# EAGLE design BATT_INPUT (EAGLE 9.6.2)
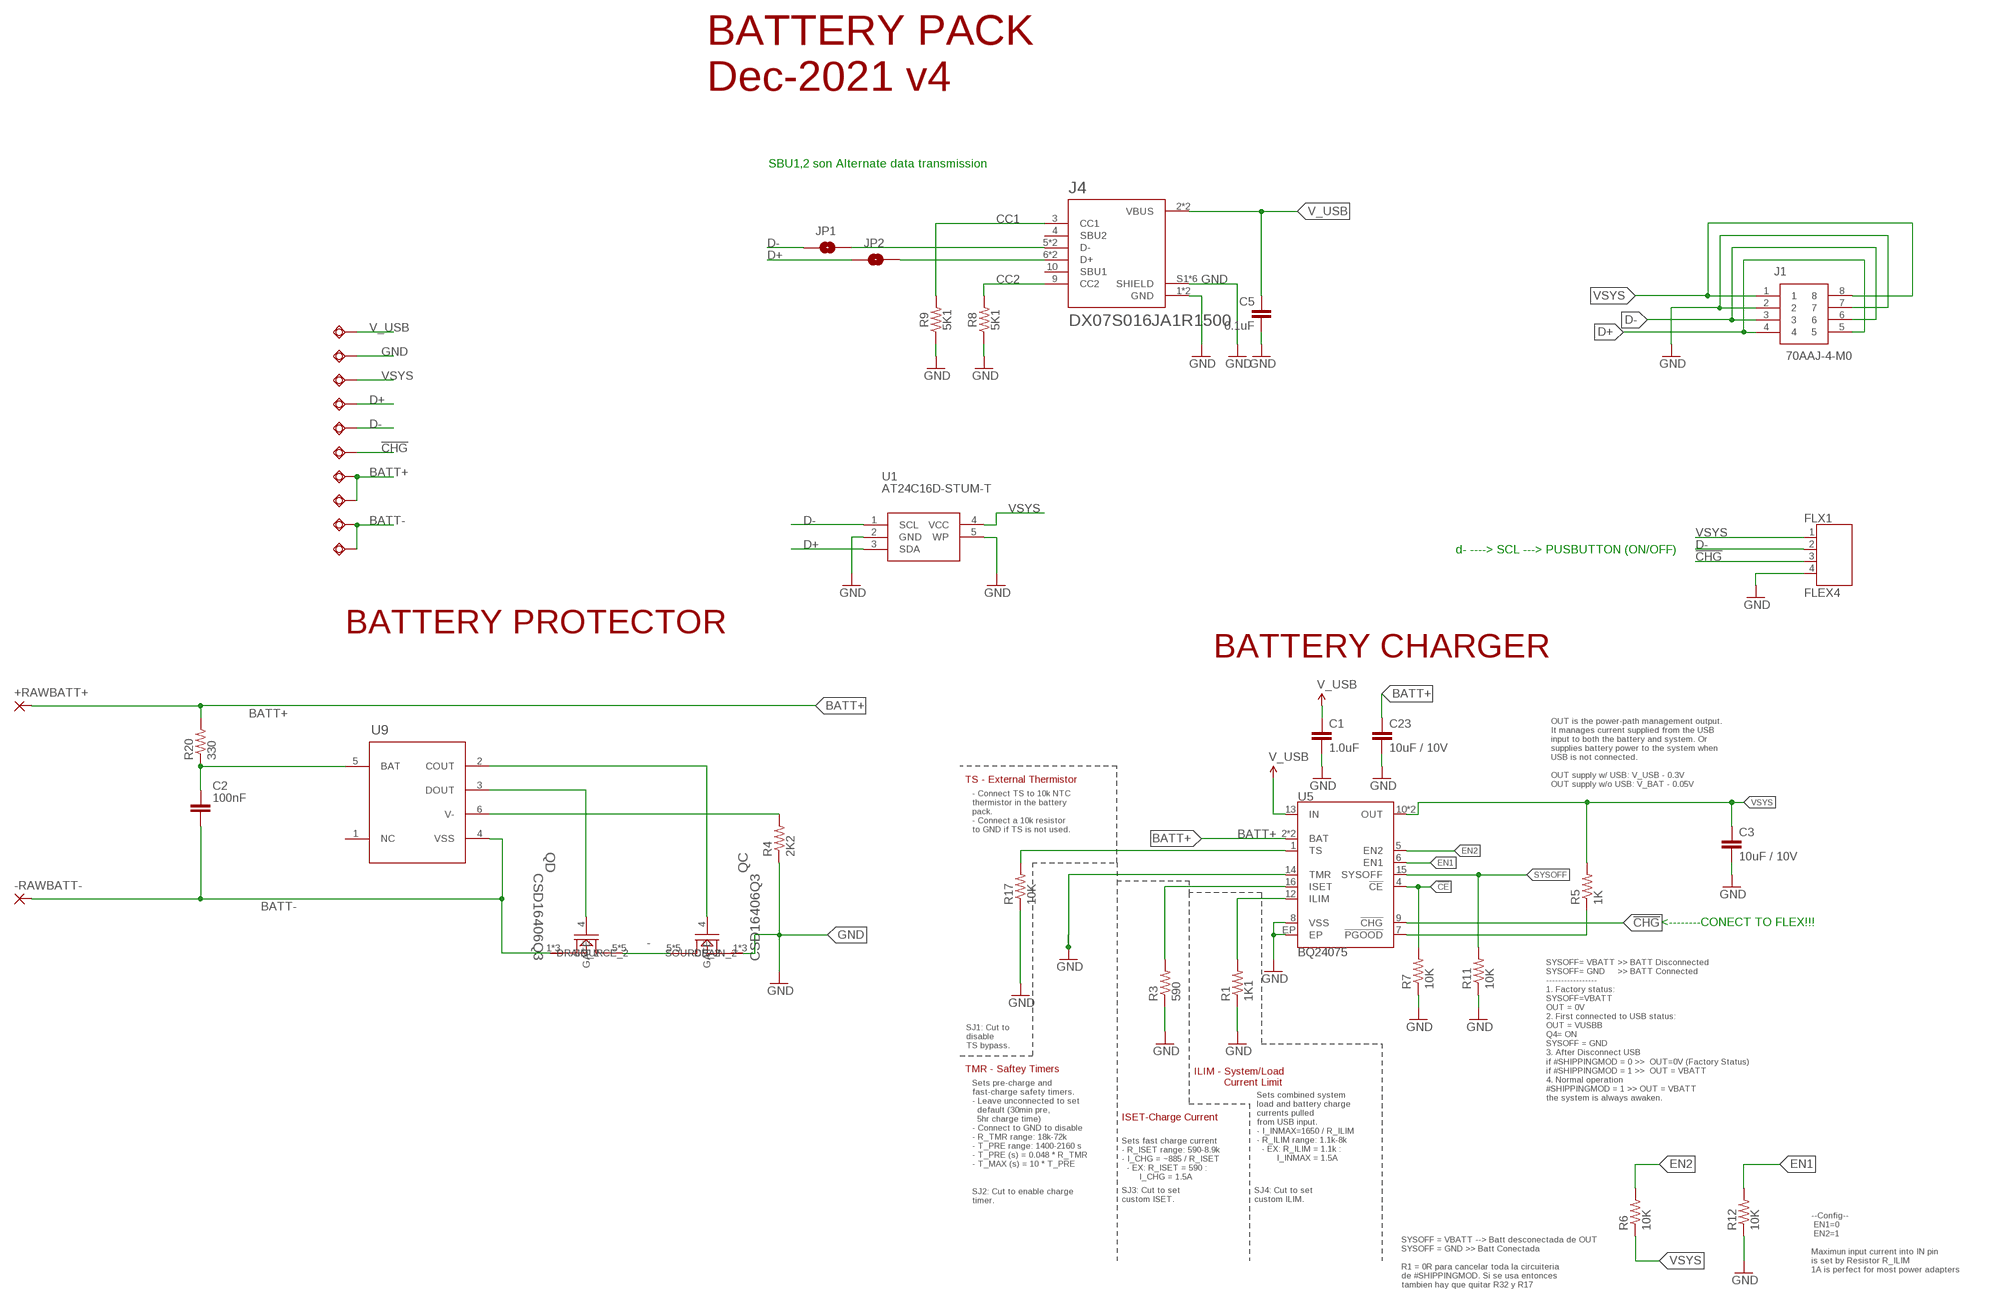
[diagram p0: schematic, sheet 1]

## Parts
!CHG!  TESTPAD_TPSQB1,27  [TESTPAD_B1,27]
+RAWBATT+  SMD5  [SMD2,54-5,08]
-RAWBATT-  SMD5  [SMD2,54-5,08]
BATT+1  TESTPAD_TPSQB1,27  [TESTPAD_B1,27]
BATT+2  TESTPAD_TPSQB1,27  [TESTPAD_B1,27]
BATT-1  TESTPAD_TPSQB1,27  [TESTPAD_B1,27]
BATT-2  TESTPAD_TPSQB1,27  [TESTPAD_B1,27]
C1  1.0uF  1.0UF-0603-16V-10%  [0603]
C2  100nF  C_CHIP-0603(1608-METRIC)  [CAPC1608X85]
C3  10uF / 10V  10UF10V10%(0805)  [0805-CAP]
C5  0.1uF  0.1UF-0603-25V-(+80/-20%)  [0603]
C23  10uF / 10V  10UF10V10%(0805)  [0805-CAP]
D+  TESTPAD_TPSQB1,27  [TESTPAD_B1,27]
D-  TESTPAD_TPSQB1,27  [TESTPAD_B1,27]
FLX1  FLEX4  [FLEX4]
GND  TESTPAD_TPSQB1,27  [TESTPAD_B1,27]
J1  70AAJ-4-M0  [70AAJ4M0]
J4  DX07S016JA1R1500  [JAE_DX07S016JA1R1500]
JP1  JUMPER-SMT_2_NO_SILK  [SMT-JUMPER_2_NO_SILK]
JP2  JUMPER-SMT_2_NO_SILK  [SMT-JUMPER_2_NO_SILK]
QC  CSD16406Q3  [DQG0008A]
QD  CSD16406Q3  [DQG0008A]
R1  1K1  RESISTOR0402  [0402]
R3  590  RESISTOR0402  [0402]
R4  2K2  RESISTOR0402  [0402]
R5  1K  RESISTOR0402  [0402]
R6  10K  RESISTOR0402  [0402]
R7  10K  RESISTOR0402  [0402]
R8  5K1  RESISTOR0402  [0402]
R9  5K1  RESISTOR0402  [0402]
R11  10K  RESISTOR0402  [0402]
R12  10K  RESISTOR0402  [0402]
R17  10K  RESISTOR0402  [0402]
R20  330  RESISTOR0402  [0402]
U1  AT24C16D-STUM-T  [SOT95P280X100-5N]
U5  BQ24075  [PVQFN-N16]
U9  Value  BQ29700DSER  [DSE0006A]
V_USB  TESTPAD_TPSQB1,27  [TESTPAD_B1,27]
VSYS  TESTPAD_TPSQB1,27  [TESTPAD_B1,27]

## Nets
!CE!: R7.2 U5.4(!CE!)
!CHG!: !CHG!.TP FLX1.3 U5.9(!CHG!)
-: QC.5(DRAIN_2) QC.6(DRAIN_2) QC.7(DRAIN_2) QC.8(DRAIN_2) QC.9(DRAIN_2) QD.5(DRAIN_2) QD.6(DRAIN_2) QD.7(DRAIN_2) QD.8(DRAIN_2) QD.9(DRAIN_2)
BATT+: +RAWBATT+.1(P) BATT+1.TP BATT+2.TP C23.1 R20.2 U5.2(BAT) U5.3(BAT)
BATT-: -RAWBATT-.1(P) BATT-1.TP BATT-2.TP C2.2 QD.1(SOURCE_2) QD.2(SOURCE_2) QD.3(SOURCE_2) U9.4(VSS)
CC1: J4.3(CC1) R9.2
CC2: J4.9(CC2) R8.2
D+: D+.TP J1.4 J1.5 JP2.1 U1.3(SDA)
D-: D-.TP FLX1.2 J1.3 J1.6 JP1.1 U1.1(SCL)
EN1: R12.2 U5.6(EN1)
EN2: R6.2 U5.5(EN2)
GND: C1.2 C3.2 C5.2 C23.2 FLX1.4 GND.TP J1.2 J1.7 J4.1(GND) J4.12(GND) J4.S1(SHIELD) J4.S2(SHIELD) J4.S3(SHIELD) J4.S4(SHIELD) J4.S5(SHIELD) J4.S6(SHIELD) QC.1(SOURCE_2) QC.2(SOURCE_2) QC.3(SOURCE_2) R1.1 R3.1 R4.1 R7.1 R8.1 R9.1 R11.1 R12.1 R17.1 U1.2(GND) U1.5(WP) U5.8(VSS) U5.14(TMR) U5.EP
ILIM: R1.2 U5.12(ILIM)
ISET: R3.2 U5.16(ISET)
N$1: R5.1 U5.7(!PGOOD!)
N$2: J4.5(D-) J4.8(D-) JP1.2
N$3: J4.6(D+) J4.7(D+) JP2.2
N$12: C2.1 R20.1 U9.5(BAT)
N$20: R4.2 U9.6(V-)
N$25: QC.4(GATE) U9.2(COUT)
N$26: QD.4(GATE) U9.3(DOUT)
SYSOFF: R11.2 U5.15(SYSOFF)
TS1: R17.2 U5.1(TS)
V_USB: C1.1 C5.1 J4.2(VBUS) J4.11(VBUS) U5.13(IN) V_USB.TP
VSYS: C3.1 FLX1.1 J1.1 J1.8 R5.2 R6.1 U1.4(VCC) U5.10(OUT) U5.11(OUT) VSYS.TP
Unconnected: J4.4(SBU2) J4.10(SBU1) U9.1(NC)

## Notes on the sheet
- BATTERY PACK
  Dec-2021 v4
- SBU1,2 son Alternate data transmission
- d- ----> SCL ---> PUSBUTTON (ON/OFF)
- BATTERY PROTECTOR
- BATTERY CHARGER
- OUT is the power-path management output.
  It manages current supplied from the USB 
  input to both the battery and system. Or
  supplies battery power to the system when 
  USB is not connected.
  
  OUT supply w/ USB: V_USB - 0.3V
  OUT supply w/o USB: V_BAT - 0.05V
- TS - External Thermistor
- - Connect TS to 10k NTC 
  thermistor in the battery
  pack.
  - Connect a 10k resistor 
  to GND if TS is not used.
- <--------CONECT TO FLEX!!!
- SYSOFF= VBATT >> BATT Disconnected
  SYSOFF= GND     >> BATT Connected
  -----------------
  1. Factory status:
  SYSOFF=VBATT
  OUT = 0V
  2. First connected to USB status:
  OUT = VUSBB
  Q4= ON
  SYSOFF = GND
  3. After Disconnect USB
  if #SHIPPINGMOD = 0 >>  OUT=0V (Factory Status)
  if #SHIPPINGMOD = 1 >>  OUT = VBATT
  4. Normal operation
  #SHIPPINGMOD = 1 >> OUT = VBATT 
  the system is always awaken.
- SJ1: Cut to 
  disable
  TS bypass.
- TMR - Saftey Timers
- ILIM - System/Load 
            Current Limit
- Sets pre-charge and
  fast-charge safety timers.
  - Leave unconnected to set
    default (30min pre, 
    5hr charge time)
  - Connect to GND to disable
  - R_TMR range: 18k-72k
  - T_PRE range: 1400-2160 s
  - T_PRE (s) = 0.048 * R_TMR
  - T_MAX (s) = 10 * T_PRE
- Sets combined system
  load and battery charge 
  currents pulled
  from USB input.
  - I_INMAX=1650 / R_ILIM
  - R_ILIM range: 1.1k-8k
    - EX: R_ILIM = 1.1k : 
          I_INMAX = 1.5A
- ISET-Charge Current
- Sets fast charge current
  - R_ISET range: 590-8.9k
  - I_CHG = ~885 / R_ISET
    - EX: R_ISET = 590 : 
         I_CHG = 1.5A
- SJ3: Cut to set
  custom ISET.
- SJ4: Cut to set
  custom ILIM.
- SJ2: Cut to enable charge
  timer.
- --Config--
   EN1=0 
   EN2=1
  
  Maximun input current into IN pin
  is set by Resistor R_ILIM
  1A is perfect for most power adapters
- SYSOFF = VBATT --> Batt desconectada de OUT
  SYSOFF = GND >> Batt Conectada
  
  R1 = 0R para cancelar toda la circuiteria
  de #SHIPPINGMOD. Si se usa entonces
  tambien hay que quitar R32 y R17

## Library data of the parts
!CHG! BATT+1 BATT+2 BATT-1 BATT-2 D+ D- GND V_USB VSYS = BeagleBone_Blue_R3:TESTPAD_TPSQ: Test pad
+RAWBATT+ -RAWBATT- = wirepad:SMD5: SMD PAD
C1 = SparkFun-Capacitors:1.0UF: 1µF ceramic capacitors A capacitor is a passive two-terminal electrical component used to store electrical energy temporarily in an electric field.; PROD_ID: CAP-00868
C2 = Tutorial - Fusion 360:C: Capacitor - Generic; CATEGORY: Capacitor
C3 C23 = SparkFun-Capacitors:10UF10V10%(0805): CAP-11330; PROD_ID: CAP-11330
C5 = SparkFun-Capacitors:0.1UF: 0.1µF ceramic capacitors A capacitor is a passive two-terminal electrical component used to store electrical energy temporarily in an electric field.; PROD_ID: CAP-00810
FLX1 = Flex4:FLEX4
J1 = ANTENNA:70AAJ-4-M0: Bourns Male 4 Way Modular Contact, Surface Mount, 3A, 60 V Source: Datasheet <https://componentsearchengine.com/Datasheets/1/70AAJ-4-M0.pdf>; DESCRIPTION: Bourns Male 4 Way Modular Contact, Surface Mount, 3A, 60 V; HEIGHT: 3.81mm; MANUFACTURER_NAME: Bourns; MANUFACTURER_PART_NUMBER: 70AAJ-4-M0; MOUSER_PART_NUMBER: 652-70AAJ-4-M0; MOUSER_PRICE-STOCK: https://www.mouser.com/Search/Refine.aspx?Keyword=652-70AAJ-4-M0
J4 = DX07S016JA1R1500:DX07S016JA1R1500: USB-C (USB TYPE-C) USB 2.0 Receptacle Connector 24 (16+8 Dummy) Position Surface Mount, Right Angle; Through Hole; DESCRIPTION: USB-C (USB TYPE-C) USB 2.0 Receptacle Connector 24 (16+8 Dummy) Position Surface Mount, Right Angle; Through Hole; DIGI-KEY_PART_NUMBER: 670-DX07S016JA1R1500CT-ND; MF: JAE Electronics; MP: DX07S016JA1R1500; PACKAGE: None; PURCHASE-URL: https://pricing.snapeda.com/search/part/DX07S016JA1R1500/?ref=eda
JP1 JP2 = SparkFun-Jumpers:JUMPER-SMT_2_NO: Normally open jumper This jumper has two pads in close proximity to each other. Apply solder to close the connection. Round pads are easier to solder for beginners, but are a lot larger. SparkFun Product that uses the round pads: SparkFun EL Sequencer <https://www.sparkfun.com/products/12781>
QC QD = CSD16406Q3:CSD16406Q3; DATASHEET_URL: http://www.ti.com/lit/ds/symlink/csd16406q3.pdf; IDSMAX: 60.0; MANUFACTURER_PART_NUMBER: CSD16406Q3; QGTYP: 5.8; QUANTITY: 1; RDSON45: 0.0059; VDSMAX: 25.0; VENDOR: Texas Instruments
R1 R3-R9 R11 R12 R17 R20 = SparkFun-Resistors:RESISTOR: Generic Resistor Package
U1 = AT24C16D-STUM-T:AT24C16D-STUM-T: EEPROM Serial-2Wire 16K-bit 2K x 8 1.8V/2.5V/3.3V 5-Pin SOT-23 T/R Source: Datasheet <https://www.arrow.com/en/products/at24c16d-stum-t/microchip-technology>; ARROW_PART_NUMBER: AT24C16D-STUM-T; ARROW_PRICE-STOCK: https://www.arrow.com/en/products/at24c16d-stum-t/microchip-technology; DESCRIPTION: EEPROM Serial-2Wire 16K-bit 2K x 8 1.8V/2.5V/3.3V 5-Pin SOT-23 T/R; HEIGHT: 1mm; MANUFACTURER_NAME: Microchip; MANUFACTURER_PART_NUMBER: AT24C16D-STUM-T; MOUSER_PART_NUMBER: 556-AT24C16D-STUM-T; MOUSER_PRICE-STOCK: https://www.mouser.co.uk/ProductDetail/Microchip-Technology-Atmel/AT24C16D-STUM-T?qs=YAvGbpKWXiSFXLERVL65hQ%3D%3D
U5 = battery-management-temp:BQ24075; PROD_ID: IC-13219
U9 = BQ2970:BQ29700DSER; MANUFACTURER: Texas Instruments; PARTNUMBER: BQ29705DSER; REFDES: RefDes; TYPE: TYPE

## Net classes
1 power: width 0.178 mm
2 gnd: width 0.305 mm, drill 0.483 mm, clearance 0.203 mm

## Board
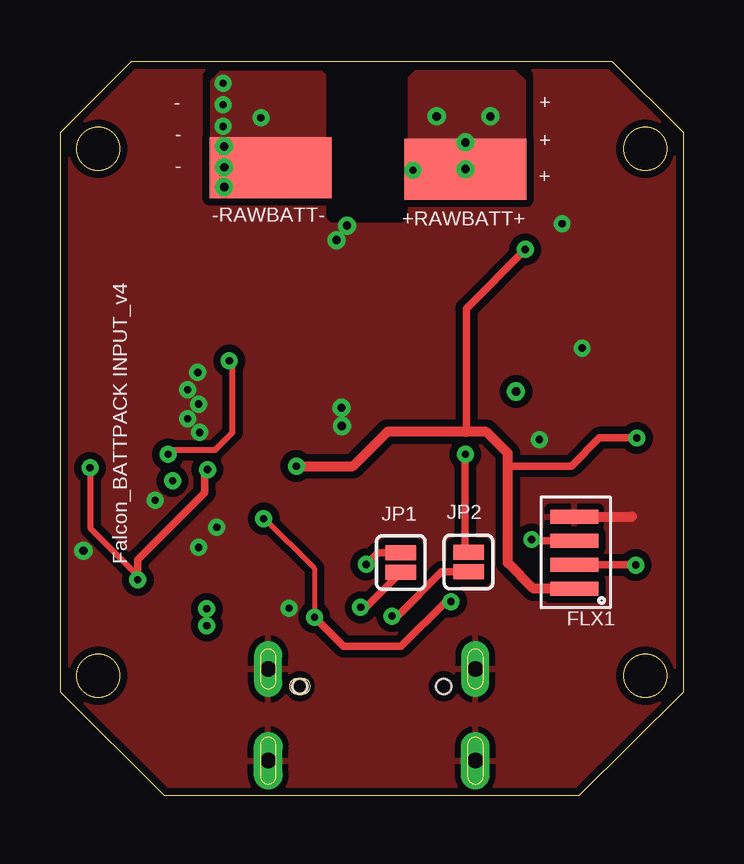
[diagram p1: board, top side]
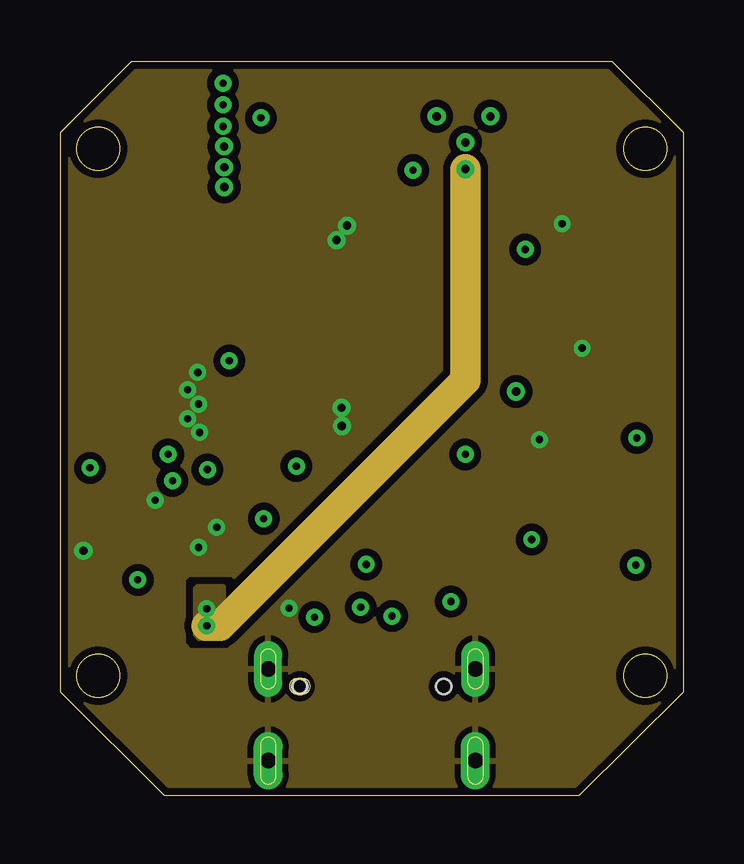
[diagram p2: board, inner layer Route2]
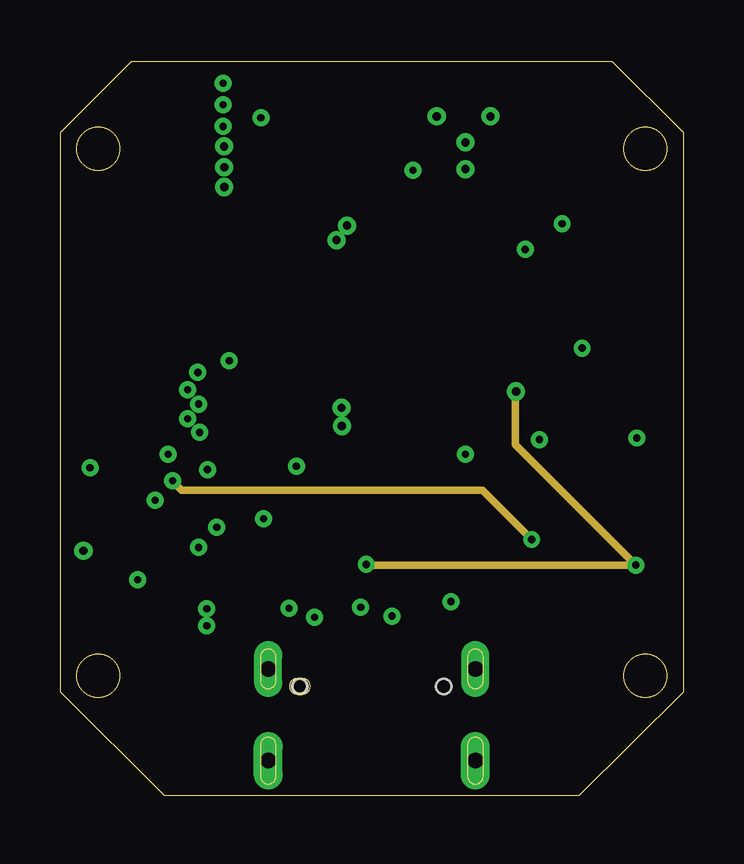
[diagram p3: board, inner layer Route15]
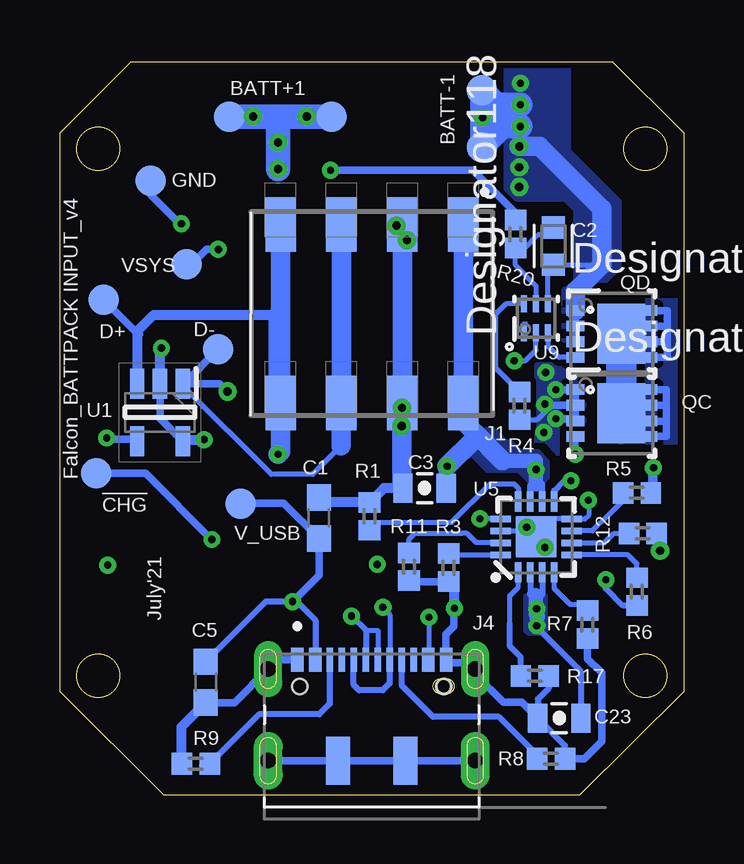
[diagram p4: board, bottom side, seen from below]

Size 26 x 30.58 mm. Coordinates in mm from the lower left corner, seen from the top.
Outline: 21.65,0 26,4.32 26,27.61 23.03,30.57 2.97,30.57 0,27.61 0,4.32 4.35,0 21.65,0
Outline: circle at 1.6,4.99 radius 0.9
Outline: circle at 24.4,4.99 radius 0.9
Outline: circle at 24.4,26.95 radius 0.9
Outline: circle at 1.6,26.95 radius 0.9
Copper layers (1+2*15+16): Top 0.035mm / dielectric 1.5mm / Route2 0.035mm / dielectric 0.15mm / Route15 0.035mm / dielectric 0.2mm / Bottom 0.035mm
Design rules "default *": minimum track width 6mil, minimum drill 0.3mm, track to track 7mil, track to pad 7mil, pad to pad 7mil, via to via 7mil, smd to smd 6mil, copper to edge 10mil, drill to drill 10mil, minimum pad ring 10mil, minimum via ring 8mil, stop-mask expansion 4mil, vias tented up to drill 50mil, thermal gap 10mil
tRestrict: area 11.4,24.2 to 14.2,30.1

### Footprints (pad centres in the part's own frame; a part is rotated, then mirrored left to right if it is on the bottom)
TESTPAD_B1,27 = smd 1.27 x 1.27: TP 0,0
SMD2,54-5,08 = smd 2.54 x 5.08: 1 0,0
0603 = smd 1.1 x 1: 1 -0.85,0; 2 0.85,0
CAPC1608X85 = smd 0.921 x 0.97: 1 -0.775,0; 2 0.775,0
0805-CAP = smd 0.8 x 1.2: 1 -0.9,0; 2 0.9,0
FLEX4 = smd 0.6 x 2: 1 -3.77,1.52; 2 -2.77,1.52; 3 -1.77,1.52; 4 -0.77,1.52
70AAJ4M0 = smd 1.27 x 2.26: 1 -3.81,-3.72; 2 -1.27,-3.72; 3 1.27,-3.72; 4 3.81,-3.72; 5 3.81,3.72; 6 1.27,3.72; 7 -1.27,3.72; 8 -3.81,3.72
JAE_DX07S016JA1R1500 = smd 0.52 x 1: 1 -3.1,1.1; 2 -2.35,1.1; 11 2.35,1.1; 12 3.1,1.1 | smd 0.27 x 1: 3 -1.75,1.1; 4 -1.25,1.1; 5 -0.75,1.1; 6 -0.25,1.1; 7 0.25,1.1; 8 0.75,1.1; 9 1.25,1.1; 10 1.75,1.1 | smd 1 x 2: S1 -1.4,-3.1; S2 1.4,-3.1 | drill 0.65 long: S3 -4.32,0.725; S4 4.32,0.725 | drill 0.65 pad 1.2 long: S5 -4.32,-3.1; S6 4.32,-3.1 | hole 0.6: 3,0 | hole 0.63: 3,0; -3,0
SMT-JUMPER_2_NO_SILK = smd 0.635 x 1.27: 1 -0.406,0; 2 0.406,0
DQG0008A = smd 0.75 x 0.44: 1 -1.525,0.975; 2 -1.525,0.325; 3 -1.525,-0.325; 4 -1.525,-0.975; 5 1.525,-0.975; 6 1.525,-0.325; 7 1.525,0.325; 8 1.525,0.975 | smd 2 x 2.5: 9 0.4,0 | smd 0.5 x 0.5: V 0.226,0.975
0402 = smd 0.85 x 0.9: 1 -0.58,0; 2 0.58,0
SOT95P280X100-5N = smd 1.25 x 0.6: 1 -1.2,0.95; 2 -1.2,0; 3 -1.2,-0.95; 4 1.2,-0.95; 5 1.2,0.95
PVQFN-N16 = smd 0.28 x 0.85: 1 -0.75,-1.475; 2 -0.25,-1.475; 3 0.25,-1.475; 4 0.75,-1.475; 9 0.75,1.475; 10 0.25,1.475; 11 -0.25,1.475; 12 -0.75,1.475 | smd 0.85 x 0.28: 5 1.475,-0.75; 6 1.475,-0.25; 7 1.475,0.25; 8 1.475,0.75; 13 -1.475,0.75; 14 -1.475,0.25; 15 -1.475,-0.25; 16 -1.475,-0.75 | smd 1.7 x 1.7: EP 0,0
DSE0006A = smd 0.66 x 0.25: 1 -0.62,0.5 | smd 0.7 x 0.25: 2 -0.6,0; 3 -0.6,-0.5; 4 0.6,-0.5; 5 0.6,0; 6 0.6,0.5

### Placement (x,y rotation side)
!CHG!  24.5,13.42 0 bottom
+RAWBATT+  16.91,26.09 90 top
-RAWBATT-  8.78,26.15 90 top
BATT+1  18.94,28.27 0 bottom
BATT+2  14.68,28.27 0 bottom
BATT-1  8.4,27.01 0 bottom
BATT-2  8.4,29.37 0 bottom
C1  15.21,11.56 90 bottom
C2  5.43,22.89 270 bottom
C3  10.8,12.8 180 bottom
C5  19.92,4.72 270 bottom
C23  5.18,3.22 180 bottom
D+  24.17,20.65 0 bottom
D-  19.4,18.6 0 bottom
FLX1  22.96,12.38 90 top
GND  22.23,25.61 0 bottom
J1  12.99,20.07 180 bottom
J4  13,4.55 0 bottom
JP1  14.21,9.7 270 top
JP2  17.03,9.72 270 top
QC  2.99,15.93 0 bottom
QD  2.99,19.23 0 bottom
R1  1K5  [0402]  13.09,11.63 270 bottom
R3  909R  [0402]  9.79,9.49 90 bottom
R4  6.84,16.23 90 bottom
R5  100k  [0402]  1.94,12.61 0 bottom
R6  1.94,8.49 90 bottom
R7  4.01,7.12 90 bottom
R8  5.52,1.53 180 bottom
R9  20.34,1.32 0 bottom
R11  11.45,9.53 90 bottom
R12  1.7,10.92 180 bottom
R17  6.2,4.98 180 bottom
R20  7.01,23.39 90 bottom
U1  21.83,15.96 270 bottom
U5  6.14,10.77 0 bottom
U9  BQ29700DSER  [DSE0006A]  6.15,19.88 90 bottom
V_USB  18.47,12.15 0 bottom
VSYS  20.72,22.12 0 bottom

### Tracks (layer width: path | path; a pad name or v marks a point on that pad's centre or on a via)
!CE!
  Bottom 0.2: R7.2 4.26,7.95 4.72,7.95 5.39,8.62 U5.4
!CHG!  (via drill 0.3)
  Top 0.305: FLX1.3 19.63,10.61 19.62,10.62 v19.67,10.66
  Route15 0.305: v19.67,10.66 17.61,12.72 5.08,12.72 v4.7,13.11
  Bottom 0.254: U5.9 5.39,12.7 5,13.09 4.72,13.09 v4.7,13.11
  Bottom 0.305: v19.67,10.66 22.43,13.42 !CHG!.TP
-
  Bottom 0.305: QD.8 0.67,20.2 0.67,19.55 | QD.7 0.67,19.55 | 0.67,19.55 0.67,18.9 | 0.67,18.9 QD.6 | QC.8 0.73,16.91 0.72,16.9 0.72,16.27 | 0.72,16.27 0.75,16.25 1.45,16.25 QC.7 | 0.72,16.27 0.72,15.62 0.75,15.6 | 0.75,15.6 QC.6 | 0.67,18.9 0.67,18.27 0.69,18.25 QD.5 | 0.75,15.6 0.72,15.57 0.72,14.97 0.74,14.96 QC.5
  Bottom 1.27: QC.9 2.59,17.57 QD.9
  pour Bottom: 2.7,20.67 2.7,14.67 0.1,14.67 0.1,20.67
BATT+  (via drill 0.3, 0.35)
  Top 0.305: +RAWBATT+.1 16.81,26 15.25,26 15.2,26.05 v14.72,26.05
  Route2 1.27: +RAWBATT+.1 16.91,17.31 6.67,7.07 v6.12,7.07
  Bottom 0.254: U5.3 5.89,8.35 5.9,8.35 6.15,8.35 6.37,8.35 6.41,8.38 6.39,8.4 U5.2 | v6.12,7.07 6.12,7.01 4.28,5.17 C23.1
  Bottom 0.305: R20.2 7.01,24.27 8.78,26.05 v14.72,26.05
  Bottom 0.61: 6.15,8.35 6.15,7.55 6.07,7.47 6.12,7.42 v6.12,7.07
  Bottom 1.016: BATT+2.TP 16.91,28.27 | 16.91,28.27 BATT+1.TP | 16.91,28.27 +RAWBATT+.1
  other vias: 16.91,26.09 6.12,7.77 15.71,28.29 17.95,28.29 16.91,27.21
  pour Bottom: 5.8,8.37 5.7,8.37 5.7,6.82 5.85,6.67 6.5,6.67 6.65,6.82 6.65,8.37
  pour Route2: 5.55,8.32 5.55,6.67 5.6,6.62 5.75,6.47 6.7,6.47 6.9,6.67 6.9,6.72 6.9,8.72 6.85,8.77 5.7,8.77 5.55,8.62
  pour Top (isolate 0.305, no thermals): 14.4,26.97 19.4,26.97 19.4,29.77 19,30.17 14.8,30.17 14.4,29.77
BATT-  (via drill 0.3, 0.35)
  Bottom 0.203: U9.4 5.65,21.92 5.46,22.11 C2.2 3.41,22.11
  Bottom 0.305: QD.3 QD.2 QD.1
  Bottom 0.813: 3.41,22.11 3.41,24.44 6.02,27.04 v6.85,27.04 v6.86,27.05 | QD.1 4.51,21.01 3.41,22.11
  Bottom 1.016: v6.8,28.77 7.8,28.77 BATT-2.TP 8.38,29.35 v8.38,28.23 8.38,27.03 BATT-1.TP 8.4,27.03 7.56,27.87 v6.8,27.87
  other vias: 6.85,26.17 6.85,25.35 6.8,29.67
  pour Top (no thermals): 10.85,25.67 9.05,25.07 9.05,25.67
  pour Bottom: 7.5,30.27 7.5,25.11 7.16,24.77 5,24.77 4.6,24.37 4.6,21.47 4.9,21.17 5,21.17 5.1,21.07 5.1,18.97 5,18.87 4.5,18.87 4.2,19.17 4.2,20.77 3.6,21.37 3.2,21.37 2.6,21.97 2.6,24.77 4.7,26.87 4.7,30.27
  pour Top (isolate 0.305, no thermals): 6.3,27.37 6.3,29.77 6.7,30.17 10.9,30.17 11.2,29.87 11.2,27.27 6.3,27.27
CC1
  Bottom 0.2: R9.2 20.11,1.25 | J4.3
  Bottom 0.254: R9.2 17.7,3.37 15.2,3.37 14.75,3.82 J4.3
CC2
  Bottom 0.254: R8.2 6.1,1.68 7.7,3.27 10.45,3.27 11.75,4.58 J4.9
D+  (via drill 0.3)
  Top 0.305: JP2.1 16.89,10.27 16.89,14.19 v16.9,14.21
  Bottom 0.305: 16.9,15.88 v16.9,14.21 | 22.74,19.37 22.74,19.22 D+.TP
  Bottom 0.406: 22.74,19.22 22.78,19.18 U1.3 | 22.74,19.37 22.09,20.02 16.88,20.02
  Bottom 0.813: J1.4 J1.5 16.8,14.31 v16.9,14.21 | 16.88,20.02 16.9,20 16.9,15.88
D-  (via drill 0.3, 0.35)
  Top 0.305: FLX1.2 v24.01,9.61 v24.02,9.61 v24.01,9.6 | v12.77,9.62 13.25,10.11 JP1.1
  Route15 0.305: v12.77,9.62 12.75,9.61 12.76,9.6 v24.01,9.6 19,14.61 19,16.81 v19.02,16.83
  Bottom 0.203: 20.88,17.07 17.18,13.37 15.47,13.37 14.28,14.56
  Bottom 0.305: D-.TP 20.83,17.16 | 20.83,17.16 U1.1 | v19.02,16.83 19.35,17.16 20.83,17.16
  Bottom 0.406: U1.1 20.88,17.07
  Bottom 0.813: J1.3 J1.6 14.28,16.33 14.28,14.56
EN1
  Bottom 0.2: U5.6 3.3,10.52 2.9,10.92 R12.2
EN2
  Bottom 0.2: R6.2 1.94,9.65 2.31,10.02 U5.5
GND  (via drill 0.3, 0.35)
  Top 0.406: FLX1.4 23.86,11.61
  Bottom 0.2: U5.14 6.39,11.02 U5.EP | U5.EP | U5.EP 6.14,10.88 5.51,11.52 U5.8 4.11,11.52 3.93,11.7 3.93,12.25 v3.97,12.29
  Bottom 0.203: R4.1 6.09,15.65 5.48,16.26
  Bottom 0.254: R17.1 5.62,4.47 6.08,4.01 C23.2 4.94,2.08 R8.1 | R12.1 1.12,10.33 v0.98,10.19
  Bottom 0.305: QC.2 QC.3 4.6,15.7 v5.32,15.7 | QC.2 QC.1 4.52,16.9 v5.32,16.9 | R3.1 11.41,8.91 R11.1 | 6.14,3.27 C23.2 6.74,3.87 7.52,3.87 8.68,5.04 J4.S4 8.93,5.52 9.78,5.52 J4.12 9.9,6.71 9.56,7.05 v9.56,7.79 | 11.74,12.84 C3.2 | J4.1 16.95,5.65 J4.S3 18.73,3.87 C5.2 | J4.S6 J4.S2 J4.S1 J4.S5 | 21.84,15.72 U1.5 21.83,15.71 U1.2 | GND.TP 22.23,25.03 20.98,23.78 v20.94,23.82 | R7.1 4.01,5.7 3.41,5.1 3.41,2.26 4.14,1.53 R8.1 | QC.2 5.48,16.26
  Bottom 0.406: C5.2 20.95,2.84 20.95,1.35 R9.1 | C1.2 15.03,12.23 13.12,12.23 R1.1 12.5,12.8 C3.2 | R3.1 9.56,8.68 v9.56,7.79 v9.55,7.79 | U1.5 20.82,14.82 v20,14.82 v19.99,14.83 | U1.2 21.83,18.5 21.73,18.6 v21.77,18.64
  Bottom 0.813: 11.72,12.86 11.74,12.84 11.74,16.33 J1.7 | v11.97,23.74 11.87,23.64 J1.2 J1.7 | J1.7 11.76,16.31 v11.76,15.39
  other vias: 5.78,16.31 5.82,15.12 5.75,17.62 11.74,16.15 11.53,23.13 6.54,11.17 5.78,10.33
  pour Top (isolate 0.305, rank 3): -0.36,31.53 -0.36,-0.24 26.59,-0.24 26.59,28.25 23.31,31.53
  pour Route2 (isolate 0.305, rank 2): -0.95,31.3 -0.95,-1.08 27.65,-1.08 27.65,31.3
  pour Bottom (isolate 0.254, rank 2): 4.1,18.05 4.1,15.37 5.2,15.37 5.2,14.17 6.2,14.17 6.2,18.05
ILIM
  Bottom 0.2: U5.12 6.88,12.79 7.06,12.97 8.07,12.97 9.67,11.37 12.77,11.37 R1.2
ISET
  Bottom 0.2: R3.2 9.74,10.02 U5.16
N$1
  Bottom 0.2: R5.1 2.52,12.29 3.12,11.69 3.12,11.7 3.8,11.02 U5.7
N$2  (via drill 0.3)
  Top 0.305: JP1.2 12.75,7.84 v12.54,7.84
  Bottom 0.203: 12.54,7.81 12.25,7.52 J4.8
  Bottom 0.254: v12.54,7.84 12.54,7.81 | J4.8 12.25,4.67 12.55,4.37 13.52,4.37 13.75,4.6 J4.5
N$3  (via drill 0.3)
  Top 0.305: JP2.2 15.91,9.31 14.07,7.47 v13.85,7.47
  Bottom 0.203: 13.25,6.87 12.75,6.87 J4.7
  Bottom 0.254: v13.85,7.47 13.25,6.87 J4.6 | J4.7
N$12
  Bottom 0.203: U9.5 6.15,21.22 7.01,22.08 R20.1 6.62,22.81 6.07,23.35 5.62,23.35 5.43,23.55 C2.1
N$20
  Bottom 0.203: U9.6 7.41,20.48 7.82,20.07 7.82,17.8 R4.2
N$25  (via drill 0.3)
  Top 0.254: v4.51,14.21 4.68,14.38 6.46,14.38 7.2,15.12 7.2,17.97 v7.06,18.11
  Bottom 0.203: QC.4 4.59,15.03 | v7.06,18.11 6.59,18.11 6.15,18.56 U9.2
  Bottom 0.254: QC.4 4.51,14.23 4.52,14.22 v4.51,14.21
N$26
  Bottom 0.203: U9.3 5.65,18.71 5.19,18.25 QD.4
SYSOFF
  Bottom 0.2: R11.2 11.45,10.67 11.2,10.92 9.26,10.92 9.03,10.92 8.64,10.53 U5.15
TS1
  Bottom 0.2: 7.24,7.16 7.24,8.32 6.89,8.67 U5.1
  Bottom 0.254: R17.2 6.78,5.76 7.25,6.22 7.25,7.16 7.24,7.16
V_USB  (via drill 0.3)
  Top 0.2: v8.5,11.53 8.54,11.53 10.61,9.46 v10.61,7.43
  Top 0.305: v10.61,7.43 11.83,6.21 14.22,6.21 16.09,8.08 v16.3,8.08
  Bottom 0.2: v8.5,11.53 v8.49,11.52 U5.13 | v10.61,7.43 10.61,5.69 J4.11
  Bottom 0.254: C5.1 17.41,8.08 v16.31,8.08 v16.3,8.08 16.29,8.09 16.14,8.09 15.35,7.3 J4.2
  Bottom 0.305: V_USB.TP 18.43,12.18 16.68,12.18 C1.1 15.21,9.17 v16.3,8.08
VSYS  (via drill 0.3)
  Top 0.254: v3.24,8.98 3.24,9.14 1.29,11.1 1.29,13.65 v1.25,13.65
  Top 0.305: v3.24,8.98 3.24,9.82 6.04,12.62 6.04,13.49 6.13,13.58 v6.15,13.58 | v24.05,14.89 22.49,14.89 21.31,13.72 18.71,13.72 18.67,13.76 | v19.4,22.75 16.94,20.29 16.94,15.15
  Top 0.406: FLX1.1 19.75,8.61 18.67,9.69 18.67,13.76 18.67,14.26 17.78,15.15 16.94,15.15 13.65,15.15 12.22,13.72 v9.86,13.72
  Bottom 0.2: U5.11
  Bottom 0.254: U5.10 5.89,12.97 5.9,12.97 6.15,12.97 6.35,12.97 6.4,12.92 6.39,12.92 U5.11 | 1.22,13.65 1.22,12.75 R5.2 1.36,13.54 v1.25,13.65 | 6.12,13.3 6.15,13.32 | v3.24,8.98 3.24,8.62 2.53,7.91 R6.1
  Bottom 0.305: U1.4 22.86,14.85 24.01,14.85 v24.05,14.89 | VSYS.TP 20.51,22.12 19.88,22.75 v19.4,22.75
  Bottom 0.406: v9.86,13.72 9.9,13.68 9.9,13.65
  Bottom 0.61: 7.55,13.95 6.15,13.95 v6.15,13.58 6.15,13.32 6.15,12.97 | 9.9,13.65 C3.1
  Bottom 0.813: 8.69,15.08 9.18,15.58 J1.8 J1.1 | 8.69,15.08 7.55,13.95 | v9.86,13.72 8.69,14.89 8.69,15.08
  pour Bottom (isolate 0.254): 5.8,12.97 5.8,13.01 5.6,13.21 5.6,13.95 6.04,14.39 6.78,14.39 7.18,14.79 7.38,14.79 7.88,15.29 8.12,15.29 8.32,15.29 8.46,15.43 8.78,15.11 8.84,15.11 8.96,14.99 8.96,14.21 8.22,13.47 6.9,13.47 6.4,12.97

### Text on the board
tNames: - | + | - | + | - | + | Falcon_BATTPACK INPUT_v4
bNames: Falcon_BATTPACK INPUT_v4 | July'21